# EasyEDA Pro project ProPrj_主控板v1.0_2025-02-24.epro, board PCB4
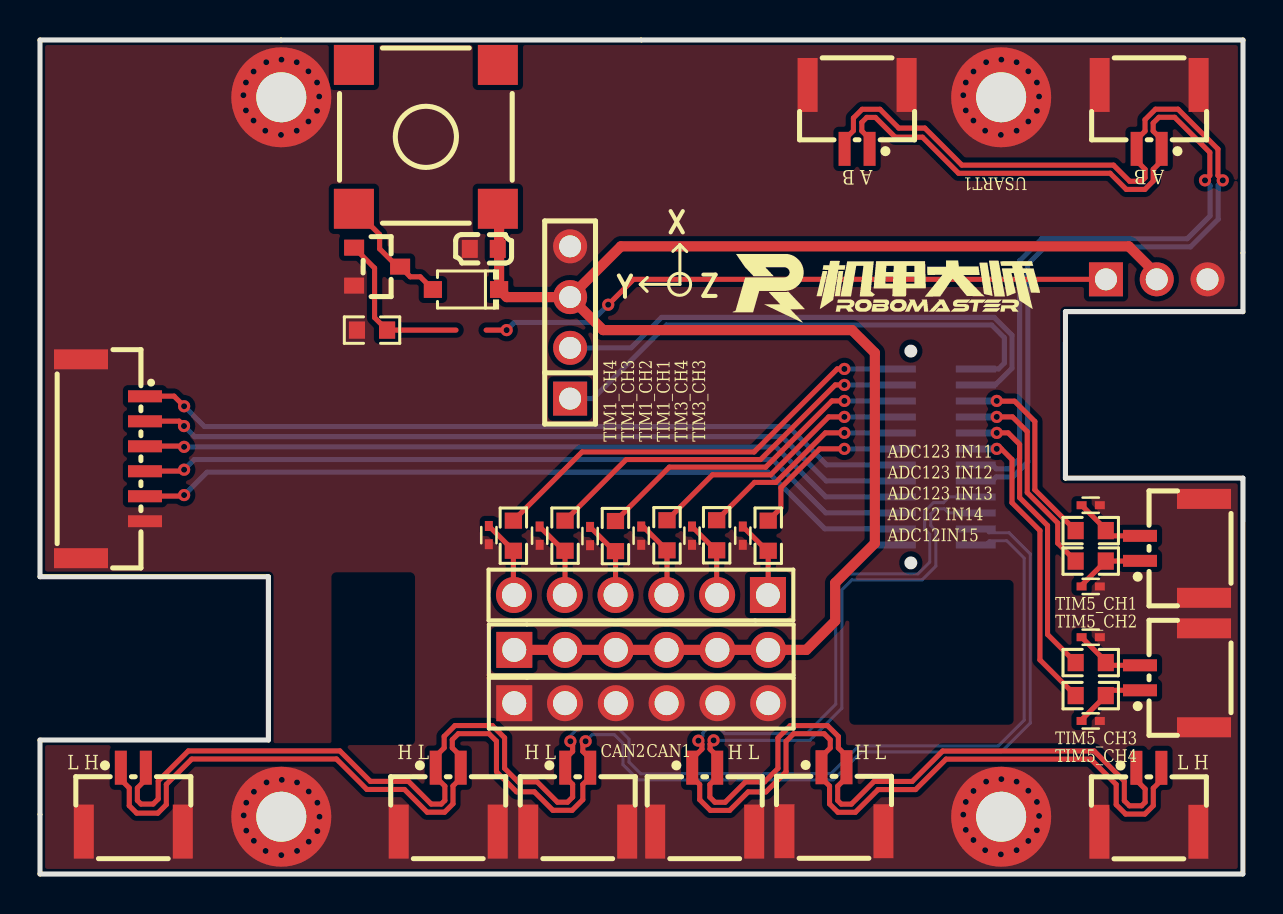
[diagram p16: board, top side]
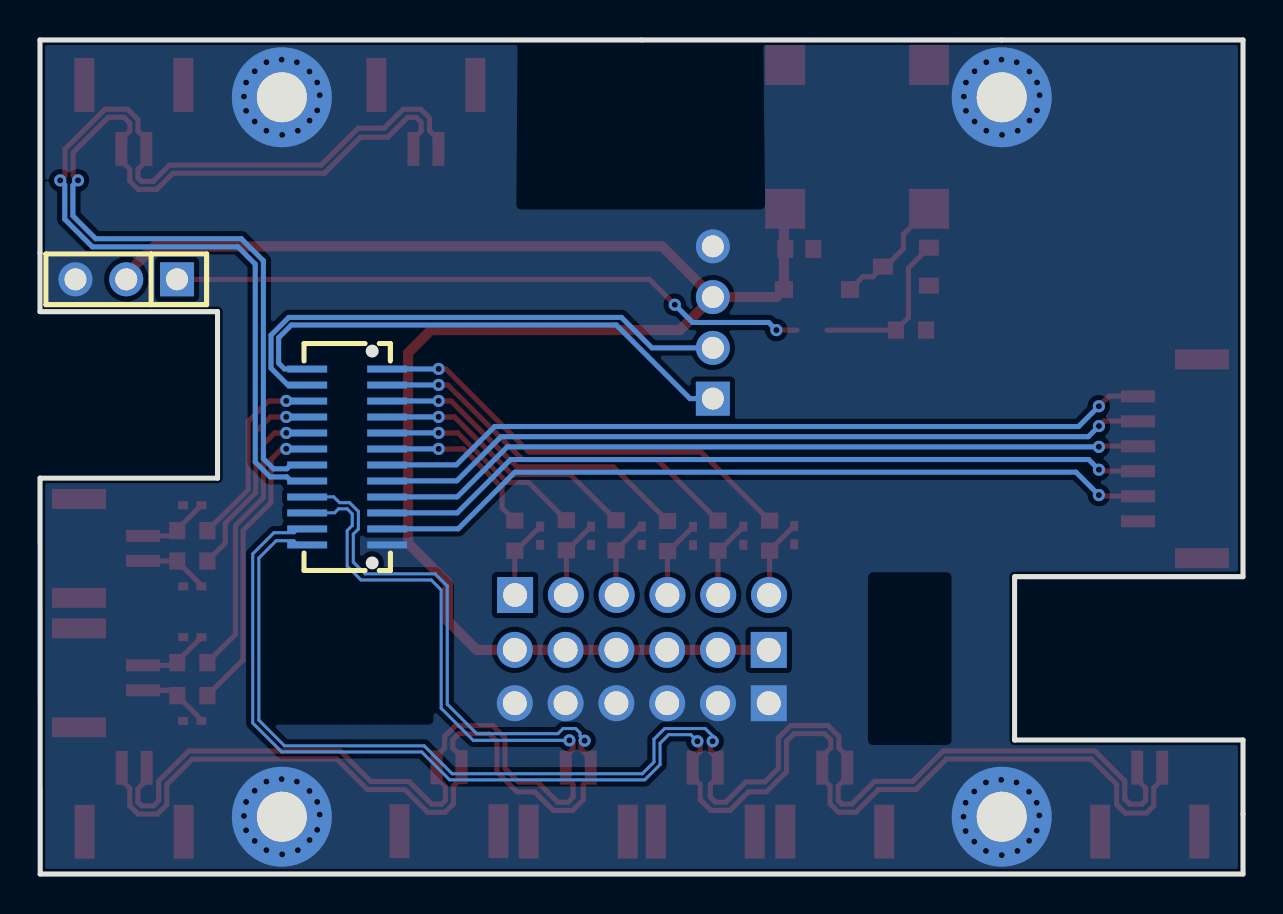
[diagram p17: board, bottom side, seen from below]

Outline 60.16 x 41.74 mm; copper layers: Top Layer, Bottom Layer. Coordinates in mm from the lower left corner of the outline.
Outline path: 0,41.74 60.16,41.74 60.16,31.08 60.16,28.14 51.28,28.14 51.28,19.81 60.16,19.81 60.15,0 0,0 0,6.71 11.42,6.71 11.42,14.88 0,14.88 0,41.74
Stack: Top Layer 0.035mm / Dielectric1 1.51mm FR4 er 4.5 / Bottom Layer 0.035mm

## Design rules (mm)
net RS485_1_A: DP3
net RS485_1_B: DP3
net CAN1-H: DP2
net CAN1-L: DP2
net CAN2-L: DP1
net CAN2-H: DP1
template: 自定义配置
spacing copperThickness1oz (default): track to track 0.102, other pairs 0.152 to 0.3
spacing copperThickness2oz: track to track 0.203, other pairs 0.152 to 0.3
track width copperThickness1oz (default): min 0.127, default 0.254, max 2.54
track width copperThickness2oz: min 0.203, default 0.254, max 2.54
differential pair differentialPair (default): width min 0.127, default 0.254, max 2.54; gap min 0.152, default 0.152
via viaSize (default): diameter min 0.5, default 0.61, max 10; hole min 0.3, default 0.305, max 6.3

## Placement (name value [footprint] x y rotation side)
BUZZER1  蜂鸣器.CY-SMD-8530D-30168.5×8.5×3mm≧80DB5VDC电磁式无源DC  [BUZ-SMD_4P-L8.5-W8.5-BR-1]  19.3 36.89 0 top
C183  22uF  [C0603]  22.19 31.28 0 top
CN11  GH1.25-2P卧贴  [CONN-SMD_2P-P1.25_X1251WRS-02HF-LPSW]  55.45 3.71 0 top
CN12  GH1.25-2P卧贴  [CONN-SMD_2P-P1.25_X1251WRS-02HF-LPSW]  33.24 3.72 0 top
CN13  GH1.25-2P卧贴  [CONN-SMD_2P-P1.25_X1251WRS-02HF-LPSW]  39.71 3.74 0 top
CN14  GH1.25-2P卧贴  [CONN-SMD_2P-P1.25_X1251WRS-02HF-LPSW]  4.67 3.72 0 top
CN15  GH1.25-2P卧贴  [CONN-SMD_2P-P1.25_X1251WRS-02HF-LPSW]  26.89 3.72 0 top
CN16  GH1.25-2P卧贴  [CONN-SMD_2P-P1.25_X1251WRS-02HF-LPSW]  20.42 3.72 0 top
CN17  GH1.25-2P卧贴  [CONN-SMD_2P-P1.25_X1251WRS-02HF-LPSW]  40.86 37.89 180 top
CN18  GH1.25-2P卧贴  [CONN-SMD_2P-P1.25_X1251WRS-02HF-LPSW]  55.47 37.89 180 top
CN19  GH1.25-2P卧贴  [CONN-SMD_2P-P1.25_X1251WRS-02HF-LPSW]  56.61 16.3 90 top
CN20  GH1.25-2P卧贴  [CONN-SMD_2P-P1.25_X1251WRS-02HF-LPSW]  56.61 9.82 90 top
D10  ESD9B5.0ST5G  [SOD-923_L0.8-W0.6-LS1.0-BI]  35.15 16.93 90 top
D11  ESD9B5.0ST5G  [SOD-923_L0.8-W0.6-LS1.0-BI]  32.61 16.93 90 top
D12  ESD9B5.0ST5G  [SOD-923_L0.8-W0.6-LS1.0-BI]  30.07 16.93 90 top
D13  ESD9B5.0ST5G  [SOD-923_L0.8-W0.6-LS1.0-BI]  27.51 16.91 90 top
D14  ESD9B5.0ST5G  [SOD-923_L0.8-W0.6-LS1.0-BI]  24.99 16.93 90 top
D15  ESD9B5.0ST5G  [SOD-923_L0.8-W0.6-LS1.0-BI]  22.45 16.96 90 top
D16  ESD9B5.0ST5G  [SOD-923_L0.8-W0.6-LS1.0-BI]  52.55 14.39 180 top
D17  ESD9B5.0ST5G  [SOD-923_L0.8-W0.6-LS1.0-BI]  52.55 18.45 180 top
D18  ESD9B5.0ST5G  [SOD-923_L0.8-W0.6-LS1.0-BI]  52.55 7.66 180 top
D19  ESD9B5.0ST5G  [SOD-923_L0.8-W0.6-LS1.0-BI]  52.55 11.85 180 top
H1  -  [HDR-TH_3P-P2.54-V-M]  55.85 29.76 0 bottom
H2  -  [HDR-TH_4P-P2.54-V-M]  26.51 27.6 90 top
H3  -  [HDR-TH_6P-P2.54-V-M-1]  30.07 11.22 0 top
H4  -  [HDR-TH_6P-P2.54-V-M-1]  30.07 8.55 0 top
H5  -  [HDR-TH_6P-P2.54-V-M-1]  30.05 13.96 180 top
NOREF  -  [Pad_e108]  48.07 38.87 90 top
NOREF#2  -  [Pad_e54]  12.07 38.87 90 top
NOREF#3  -  [Pad_e89]  48.07 2.87 90 top
NOREF#4  -  [Pad_e107]  12.07 2.87 90 top
Q31  -  [S8050_SOT-23]  16.86 30.52 180 top
R159  10K  [R0603]  16.61 27.22 180 top
R178  22R  [R0603]  36.42 16.93 270 top
R179  22R  [R0603]  33.84 16.95 270 top
R180  22R  [R0603]  31.36 16.95 270 top
R181  22R  [R0603]  28.78 16.91 270 top
R182  22R  [R0603]  26.26 16.93 270 top
R183  22R  [R0603]  23.67 16.93 270 top
R184  22R  [R0603]  52.55 15.66 0 top
R185  22R  [R0603]  52.55 17.18 0 top
R186  22R  [R0603]  52.55 8.93 0 top
R187  22R  [R0603]  52.55 10.58 0 top
U19  SD103AWS  [SOD-123_L2.7-W1.7-LS3.8-RD]  21.3 29.25 180 top
U29  SGDBF-08-024P-H40  [CONN-SMD_24P-P0.80_SGDBF-08-024P-H40]  44.8 20.87 90 bottom
U30  GH1.25-6PWBPZ  [CONN-SMD_6P-P1.25_GH1.25-6PWBPZ]  3.65 20.78 270 top

## Footprints (pads in the part's own frame, mm; a bottom-side part is the same pattern mirrored in y, then rotated)
BUZ-SMD_4P-L8.5-W8.5-BR-1
  rect 2x2 smd: 1(3.6,-3.6) 2(-3.6,-3.6) 3(-3.6,3.6) 4(3.599,3.599)
C0603
  rect 0.8x0.9 smd: 1(-0.7,0) 2(0.7,0)
CONN-SMD_2P-P1.25_X1251WRS-02HF-LPSW
  rect 0.6x1.7 smd: 1(-0.625,1.6) 2(0.625,1.6)
  rect 1x2.7 smd: 3(2.475,-1.6) 4(-2.475,-1.6)
CONN-SMD_6P-P1.25_GH1.25-6PWBPZ
  rect 0.6x1.7 smd: 1(-3.125,1.6) 2(-1.875,1.6) 3(-0.625,1.6) 4(0.625,1.6) 5(1.875,1.6) 6(3.125,1.6)
  rect 1x2.7 smd: 7(-4.975,-1.6) 8(4.975,-1.6)
CONN-SMD_24P-P0.80_SGDBF-08-024P-H40
  rect 0.35x2 smd: 1(-4.4,-2) 2(-3.6,-2) 3(-2.8,-2) 4(-2,-2) 5(-1.2,-2) 6(-0.4,-2) 7(0.4,-2) 8(1.2,-2) 9(2,-2) 10(2.8,-2) 11(3.6,-2) 12(4.4,-2) 13(4.4,2) 14(3.6,2) 15(2.8,2) 16(2,2) 17(1.2,2) 18(0.4,2) 19(-0.4,2) 20(-1.2,2) 21(-2,2) 22(-2.8,2) 23(-3.6,2) 24(-4.4,2)
HDR-TH_3P-P2.54-V-M
  rect 1.7x1.7 hole 1.1: 1(-2.54,0)
  round 1.7 hole 1.1: 2(0,0) 3(2.54,0)
HDR-TH_4P-P2.54-V-M
  rect 1.7x1.7 hole 1.1: 1(-3.81,0)
  round 1.7 hole 1.1: 2(-1.27,0) 3(1.27,0) 4(3.81,0)
HDR-TH_6P-P2.54-V-M-1
  rect 1.8x1.8 hole 1.2: 1(-6.35,0)
  round 1.8 hole 1.2: 2(-3.81,0) 3(-1.27,0) 4(1.27,0) 5(3.81,0) 6(6.35,0)
Pad_e54
  round 5 hole 2.5: 101(0,0)
Pad_e89
  round 5 hole 2.5: 101(0,0)
Pad_e107
  round 5 hole 2.5: 101(0,0)
Pad_e108
  round 5 hole 2.5: 101(0,0)
R0603
  rect 0.806x0.864 smd: 1(-0.753,0) 2(0.753,0)
S8050_SOT-23
  rect 1x0.8 smd: 1(1.15,-0.823) 2(1.15,1.077) 3(-1.15,0.127)
SOD-123_L2.7-W1.7-LS3.8-RD
  rect 0.91x0.84 smd: 1(-1.655,0) 2(1.655,0)
SOD-923_L0.8-W0.6-LS1.0-BI
  rect 0.5x0.4 smd: 1(-0.457,0) 2(0.457,0)

## Nets
As in the schematic, except:
GND: C183.1 CN11.3 CN11.4 CN12.3 CN12.4 CN13.3 CN13.4 CN14.3 CN14.4 CN15.3 CN15.4 CN16.3 CN16.4 CN17.3 CN17.4 CN18.3 CN18.4 CN19.3 CN19.4 CN20.3 CN20.4 D10.1 D11.1 D12.1 D13.1 D14.1 D15.1 D16.1 D17.1 D18.1 D19.1 H1.3 H2.4 H4.1 H4.2 H4.3 H4.4 H4.5 H4.6 NOREF.101 NOREF#2.101 NOREF#3.101 NOREF#4.101 Q31.2 R159.2 U29.1 U30.6 U30.7 U30.8

Pads without a net: BUZZER1 3 4

## Via types
v1: diameter 0.45, hole 0.3, Top Layer to Bottom Layer, 64 vias
v2: diameter 0.61, hole 0.305, Top Layer to Bottom Layer, 23 vias

## Routing (per net, layer and track width the routed paths; a pad name or vN(x,y) marks a point on that pad's centre or on a via; arc(x,y) is an arc through that point)
GND:
  vias: v1(10.17,38.97) v1(10.19,2.93) v1(10.3,39.61) v1(10.3,38.21) v1(10.31,3.57) v1(10.31,2.17) v1(10.68,40.16) v1(10.68,37.7) v1(10.7,4.12) v1(10.7,1.66) v1(11.31,40.62) v1(11.27,37.19) v1(11.28,1.16) v1(11.33,4.58) v1(12.08,40.75) v1(12.05,36.99) v1(12.09,4.71) v1(12.07,0.95) v1(12.84,40.62) v1(12.84,37.19) v1(12.85,4.58) v1(12.85,1.16) v1(13.42,40.17) v1(13.42,37.66) v1(13.44,4.13) v1(13.44,1.62) v1(13.86,39.61) v1(13.86,38.19) v1(13.87,3.57) v1(13.87,2.15) v1(13.96,38.91) v1(13.98,2.87) v1(46.17,38.97) v1(46.17,2.97) v1(46.3,39.61) v1(46.3,38.21) v1(46.3,3.61) v1(46.3,2.21) v1(46.68,40.16) v1(46.68,37.7) v1(46.68,4.16) v1(46.68,1.7) v1(47.31,40.62) v1(47.27,37.19) v1(47.31,4.62) v1(47.27,1.19) v1(48.08,40.75) v1(48.05,36.99) v1(48.08,4.75) v1(48.05,0.99) v1(48.84,40.62) v1(48.84,37.19) v1(48.84,4.62) v1(48.84,1.19) v1(49.42,40.17) v1(49.42,37.66) v1(49.42,4.17) v1(49.42,1.66) v1(49.86,39.61) v1(49.86,38.19) v1(49.86,3.61) v1(49.86,2.19) v1(49.96,38.91) v1(49.96,2.91)
VCC_5V: length 86.3
  Top Layer w0.508: H1.2 55.85,30.01 54.45,31.41 29.05,31.41 H2.3 ; H2.3 23.34,28.87 U19.1 22.96,33.23 BUZZER1.1 ; H2.3 28.16,27.22 40.61,27.22 41.75,26.07 41.75,16.55 39.77,14.56 39.77,12.66 38.32,11.22 H3.6 H3.5 H3.4 H3.3 H3.2 H3.1
ADC12_IN14: length 38.3
  Top Layer w0.254: v2(7.21,20.23) 7.14,20.16 5.36,20.16
  Bottom Layer w0.254: 42.36,18.07 39.29,18.07 36.63,20.74 7.71,20.74 v2(7.21,20.23)
ADC12_IN15: length 38.7
  Top Layer w0.254: v2(7.21,18.96) 7.16,18.91 5.36,18.91
  Bottom Layer w0.254: 42.36,17.27 39.24,17.27 36.41,20.11 8.35,20.11 v2(7.21,18.96)
ADC123_IN11: length 38.4
  Top Layer w0.254: 5.36,23.91 6.7,23.91 v2(7.21,23.41)
  Bottom Layer w0.254: 42.36,20.47 39.34,20.47 37.42,22.39 8.22,22.39 v2(7.21,23.41)
ADC123_IN12: length 38.2
  Top Layer w0.254: 5.36,22.66 6.96,22.66 v2(7.2,22.42)
  Bottom Layer w0.254: v2(7.2,22.42) 7.73,21.88 37.11,21.88 39.32,19.67 42.36,19.67
ADC123_IN13: length 38.1
  Top Layer w0.254: 5.36,21.41 7.17,21.41 v2(7.21,21.38)
  Bottom Layer w0.254: 42.36,18.87 39.3,18.87 36.79,21.38 v2(7.21,21.38)
CAN1-H: length 61.8
  Top Layer w0.254: 56.1,5.32 56.1,4.72 55.67,4.29 55.67,3.42 55.25,3 54.29,3 53.82,3.47 53.82,4.48 52.55,5.75 45.31,5.75 43.79,4.23 41.91,4.23 40.78,3.09 39.9,3.09 39.48,3.51 39.48,4.4 39.1,4.79 39.1,5.89 39.52,6.31 39.52,6.72 39.21,7.02 37.69,7.02 37.31,6.64 37.31,5.12 36.3,4.11 35.42,4.11 34.49,3.19 33.53,3.19 32.99,3.72 32.99,4.48 32.62,4.85 32.62,5.32 ; v2(32.93,6.67) 33.1,6.5 33.1,6.25 32.62,5.76 CN12.1
  Bottom Layer w0.152: v2(32.93,6.67) 33.15,6.9 33.15,7.06 33.37,7.28 34,7.28 34.26,7.02 38.32,7.02 39.8,8.5 39.8,14.42 40.4,15.02 43.91,15.02 44.49,15.61 44.49,17.01 44.24,17.26 44.24,18.14 44.68,18.58 45.18,18.58 45.47,18.87 46.36,18.87
CAN1-L: length 59.2
  Top Layer w0.254: 33.87,5.32 33.87,4.85 33.5,4.48 33.5,3.85 33.75,3.59 34.26,3.59 35.28,4.61 36.23,4.61 36.9,5.28 36.9,6.81 37.52,7.43 39.38,7.43 39.93,6.88 39.93,6.31 40.35,5.89 40.35,4.85 39.89,4.39 39.89,3.68 40.07,3.5 40.58,3.5 41.71,4.63 43.62,4.63 45.14,6.16 52.72,6.16 54.23,4.65 54.23,3.67 54.48,3.41 55.09,3.41 55.27,3.59 55.27,4.26 54.85,4.68 54.85,5.32 ; CN12.2 33.87,5.89 33.51,6.25 33.51,6.51 v2(33.69,6.69)
  Bottom Layer w0.152: 46.36,18.07 45.43,18.07 45.23,18.28 44.8,18.28 44.55,18.02 44.55,17.44 44.8,17.18 44.8,15.41 44.11,14.72 40.6,14.72 40.1,14.22 40.1,8.29 38.49,6.69 v2(33.69,6.69)
CAN2-H: length 73.3
  Top Layer w0.254: CN14.2 5.29,4.73 4.87,4.31 4.87,3.68 5.05,3.5 5.66,3.5 5.91,3.76 5.91,4.65 7.42,6.16 15,6.16 16.52,4.64 18.43,4.64 19.56,3.5 20.07,3.5 20.25,3.68 20.25,4.4 19.79,4.86 CN16.1 19.79,5.89 20.21,6.31 20.21,6.89 20.75,7.43 22.62,7.43 23.23,6.82 23.23,5.29 23.91,4.61 24.86,4.61 25.88,3.6 26.38,3.6 26.64,3.85 26.64,4.48 26.27,4.86 CN15.1 26.27,5.76 26.64,6.14 26.64,6.53 v2(26.52,6.64)
  Bottom Layer w0.152: 46.36,16.47 47.26,16.47 47.47,16.68 48.35,16.68 49.22,15.81 49.22,7.7 47.93,6.42 40.95,6.42 39.55,5.02 30.04,5.02 29.46,5.6 29.46,6.75 28.92,7.28 26.89,7.28 26.52,6.91 v2(26.52,6.64)
CAN2-L: length 74.8
  Top Layer w0.254: CN14.1 4.04,4.73 4.46,4.31 4.46,3.42 4.84,3.05 5.89,3.05 6.32,3.47 6.32,4.48 7.59,5.75 14.83,5.75 16.35,4.23 18.23,4.23 19.36,3.1 20.24,3.1 20.65,3.51 20.65,4.41 21.04,4.79 CN16.2 21.04,5.89 20.62,6.31 20.62,6.72 20.92,7.02 22.45,7.02 22.83,6.65 22.83,5.12 23.83,4.11 24.72,4.11 25.65,3.19 26.61,3.19 27.15,3.72 27.15,4.48 27.52,4.86 CN15.2 27.52,5.76 27.15,6.14 27.15,6.5 v2(27.29,6.64)
  Bottom Layer w0.152: 46.36,17.27 47.25,17.27 47.45,17.08 48.46,17.08 49.52,16.02 49.52,7.56 48.08,6.11 41.07,6.11 39.68,4.71 29.92,4.71 29.15,5.48 29.15,6.54 28.72,6.97 27.62,6.97 v2(27.29,6.64)
I2C3_SCL: length 27.3
  Bottom Layer w0.254: H2.2 29.56,26.33 31.08,27.85 47.72,27.85 48.61,26.96 48.61,25.31 47.77,24.47 46.36,24.47
I2C3_SDA: length 26.8
  Bottom Layer w0.254: H2.1 27.65,23.79 31.34,27.47 47.59,27.47 48.23,26.84 48.23,25.57 47.94,25.27 46.36,25.27
RS485_1_A: length 51.4
  Top Layer w0.254: CN17.1 41.49,36.79 41.1,37.18 41.1,37.61 41.34,37.86 41.78,37.86 42.77,36.87 44.13,36.87 45.93,35.07 53.52,35.07 54.33,34.26 55.25,34.26 55.67,34.67 55.67,35.26 56.09,35.68 CN18.1 56.09,36.75 55.67,37.18 55.67,37.58 55.96,37.87 56.74,37.87 58.5,36.11 58.5,34.95 v2(58.26,34.71)
  Bottom Layer w0.254: 46.36,20.47 47.62,20.47 47.82,20.28 48.48,20.28 48.99,20.79 48.99,30.69 50.09,31.79 57.37,31.79 58.52,32.93 58.52,34.46 v2(58.26,34.71)
RS485_1_B: length 53.5
  Top Layer w0.254: v2(59.15,34.71) 58.91,34.95 58.91,36.27 56.91,38.27 55.79,38.27 55.26,37.75 55.26,37.17 54.84,36.75 CN18.2 54.84,35.69 55.26,35.27 55.26,34.84 55.08,34.66 54.49,34.66 53.68,35.47 46.1,35.47 44.25,37.33 42.95,37.33 42,38.27 41.12,38.27 40.68,37.83 40.68,37.19 40.24,36.75 CN17.2
  Bottom Layer w0.254: 46.36,19.67 47.62,19.67 47.82,19.87 48.65,19.87 49.4,20.62 49.4,30.52 50.26,31.38 57.54,31.38 58.92,32.76 58.92,34.48 v2(59.15,34.71)
TIM1_CH1: length 13.2
  Top Layer w0.254: R180.1 33.63,19.98 36.54,19.98 39.44,22.87 v2(40.23,22.87)
  Bottom Layer w0.254: 42.36,22.87 v2(40.23,22.87)
TIM1_CH2: length 16.1
  Top Layer w0.254: 28.78,17.66 31.47,20.36 36.29,20.36 39.6,23.67 v2(40.23,23.67)
  Bottom Layer w0.254: 42.36,23.67 v2(40.23,23.67)
TIM1_CH3: length 18.9
  Top Layer w0.254: v2(40.23,24.47) 39.77,24.47 36.04,20.74 29.31,20.74 R182.1
  Bottom Layer w0.254: 42.36,24.47 v2(40.23,24.47)
TIM1_CH4: length 21.8
  Top Layer w0.254: v2(40.23,25.27) 39.87,25.27 35.72,21.12 27.11,21.12 R183.1
  Bottom Layer w0.254: 42.36,25.27 v2(40.23,25.27)
TIM3_CH3: length 8
  Top Layer w0.254: R178.1 37.05,18.32 37.05,19.34 38.99,21.27 v2(40.23,21.27)
  Bottom Layer w0.254: 42.36,21.27 v2(40.23,21.27)
TIM3_CH4: length 10.3
  Top Layer w0.254: v2(40.23,22.07) 39.27,22.07 36.8,19.6 35.73,19.6 R179.1
  Bottom Layer w0.254: 42.36,22.07 v2(40.23,22.07)
TIM4_CH1: length 40.3
  Top Layer w0.254: Q31.1 16.73,30.32 16.73,27.84 R159.1 20.8,27.22 ; v2(23.34,27.22) 22.31,27.22 ; H1.1 29.69,29.76 v2(28.42,28.49)
  Bottom Layer w0.254: v2(28.42,28.49) 27.53,27.6 23.72,27.6 v2(23.34,27.22)
TIM5_CH1: length 10.1
  Top Layer w0.254: R185.1 49.75,19.23 49.75,22.65 48.74,23.66 47.86,23.66 v2(47.85,23.67)
  Bottom Layer w0.254: 46.36,23.67 v2(47.85,23.67)
TIM5_CH2: length 10.8
  Top Layer w0.254: v2(47.85,22.87) 48.63,22.87 49.37,22.14 49.37,19.09 50.89,17.57 50.89,16.56 R184.1
  Bottom Layer w0.254: 46.36,22.87 v2(47.85,22.87)
TIM5_CH3: length 14.9
  Top Layer w0.254: R187.1 50.39,11.99 50.39,17.44 48.99,18.84 48.99,21.5 48.42,22.07 v2(47.85,22.07)
  Bottom Layer w0.254: 46.36,22.07 v2(47.85,22.07)
TIM5_CH4: length 15.6
  Top Layer w0.254: v2(47.85,21.27) 48.08,21.27 48.61,20.74 48.61,18.58 50.01,17.18 50.01,10.72 R186.1
  Bottom Layer w0.254: 46.36,21.27 v2(47.85,21.27)
$1N2455: length 4
  Top Layer w0.254: D10.2 36.36,16.18 R178.2 36.42,13.98 H5.1
$1N2456: length 4
  Top Layer w0.254: D11.2 33.8,16.2 R179.2 33.84,13.99 H5.2
$1N2457: length 4
  Top Layer w0.254: H5.3 31.36,14 R180.2 30.16,17.39 D12.2
$1N2458: length 4
  Top Layer w0.254: H5.4 28.78,16.15 R181.2 28.72,16.16 D13.2
$1N2790: length 4
  Top Layer w0.254: H5.5 26.26,13.98 R182.2 26.2,16.18 D14.2
$1N2795: length 4
  Top Layer w0.254: H5.6 23.67,13.99 R183.2 23.67,16.19 D15.2
$1N3267: length 3.5
  Top Layer w0.254: CN19.1 55,15.66 R184.2 52.09,14.45 D16.2
$1N3268: length 3.6
  Top Layer w0.254: D17.2 53.3,17.24 R185.2 53.56,16.92 CN19.2
$1N3411: length 3.6
  Top Layer w0.254: CN20.1 53.56,9.19 R186.2 52.09,7.72 D18.2
$1N3412: length 3.5
  Top Layer w0.254: D19.2 53.3,10.64 R187.2 53.44,10.44 CN20.2
$1N3770: length 6
  Top Layer w0.254: U19.2 19.01,29.88 18.52,29.88 Q31.3 17.87,30.39 16.99,31.28 16.99,32 15.7,33.29

## Copper pours and planes (outline as drawn; the poured copper is in the pictures)
GND on Top Layer: -5.11,45.38 63.98,45.38 64.61,44.74 64.61,-1.48 63.21,-2.88 -2.95,-2.88 -5.11,-0.72
GND on Bottom Layer: -5.87,45 66.26,45 66.52,44.74 66.52,-1.87 62.96,-5.42 -5.87,-5.42

## Text on the board
Top Silkscreen Layer: X | Y | Z | CAN2 | CAN1 | TIM1_CH4 | TIM1_CH2 | TIM1_CH1 | TIM3_CH4 | USART1 | ADC123 IN11 / ADC123 IN12 / ADC123 IN13 / ADC12 IN14 / ADC12IN15 | TIM5_CH4 | TIM1_CH3 | TIM3_CH3 | TIM5_CH1 | TIM5_CH2 | TIM5_CH3 | L H | H L | A B
